# Altium schematic sheet DIgital Isolation.SchDoc
size A4
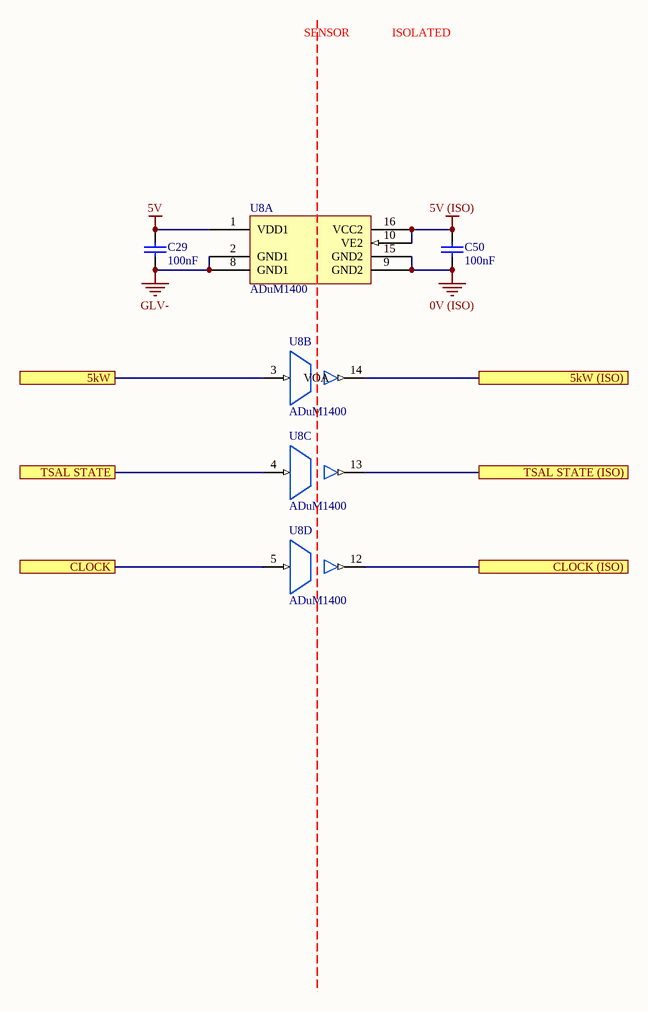
[diagram p0: DIgital Isolation.SchDoc]

## Parts
C29  100nF  [0805]
C50  100nF  [0805]
U8  ADuM1400  [AD 16-SOIC]  (parts A,B,C,D of 5)

## Ports
5kW, 5kW (ISO), CLOCK, CLOCK (ISO), TSAL STATE, TSAL STATE (ISO)

## Nets
0V (ISO): C50.1 U8.9(GND2) U8.15(GND2)
5V: C29.2 U8.1(VDD1)
5V (ISO): C50.2 U8.10(VE2) U8.16(VCC2)
GLV-: C29.1 U8.2(GND1) U8.8(GND1)
5kW: U8.3(VIA) ; port 5kW
5kW (ISO): U8.14(VOA) ; port 5kW (ISO)
CLOCK: U8.5(VIC) ; port CLOCK
CLOCK (ISO): U8.12(VOC) ; port CLOCK (ISO)
TSAL STATE: U8.4(VIB) ; port TSAL STATE
TSAL STATE (ISO): U8.13(VOB) ; port TSAL STATE (ISO)

## Notes on the sheet
- SENSOR
- ISOLATED

## Library data of the parts
C29 C50 = GCM21BR71E104KA37L: Manufacturer: muRata; Tolerance: 10%; Material: X7R; Rated Voltage: 25V; Part Number: GCM21BR71E104KA37L; Value: 100nF
U8 = ADuM1400: General Purpose Digital Isolator 2500Vrms 4 Channel 1Mbps 25kV/µs CMTI 16-SOIC (0.295", 7.50mm Width); Manufacturer: Analog Devices; Part Number: ADuM1400; Digikey Part Number: ADUM1400WSRWZ-ND; Digikey Link: https://www.digikey.com/product-detail/en/analog-devices-inc/ADUM1400WSRWZ/ADUM1400WSRWZ-ND/1873713